# Altium schematic sheet Tubes_schematc.SchDoc
size A3; SheetNumber: 1; SheetTotal: 1
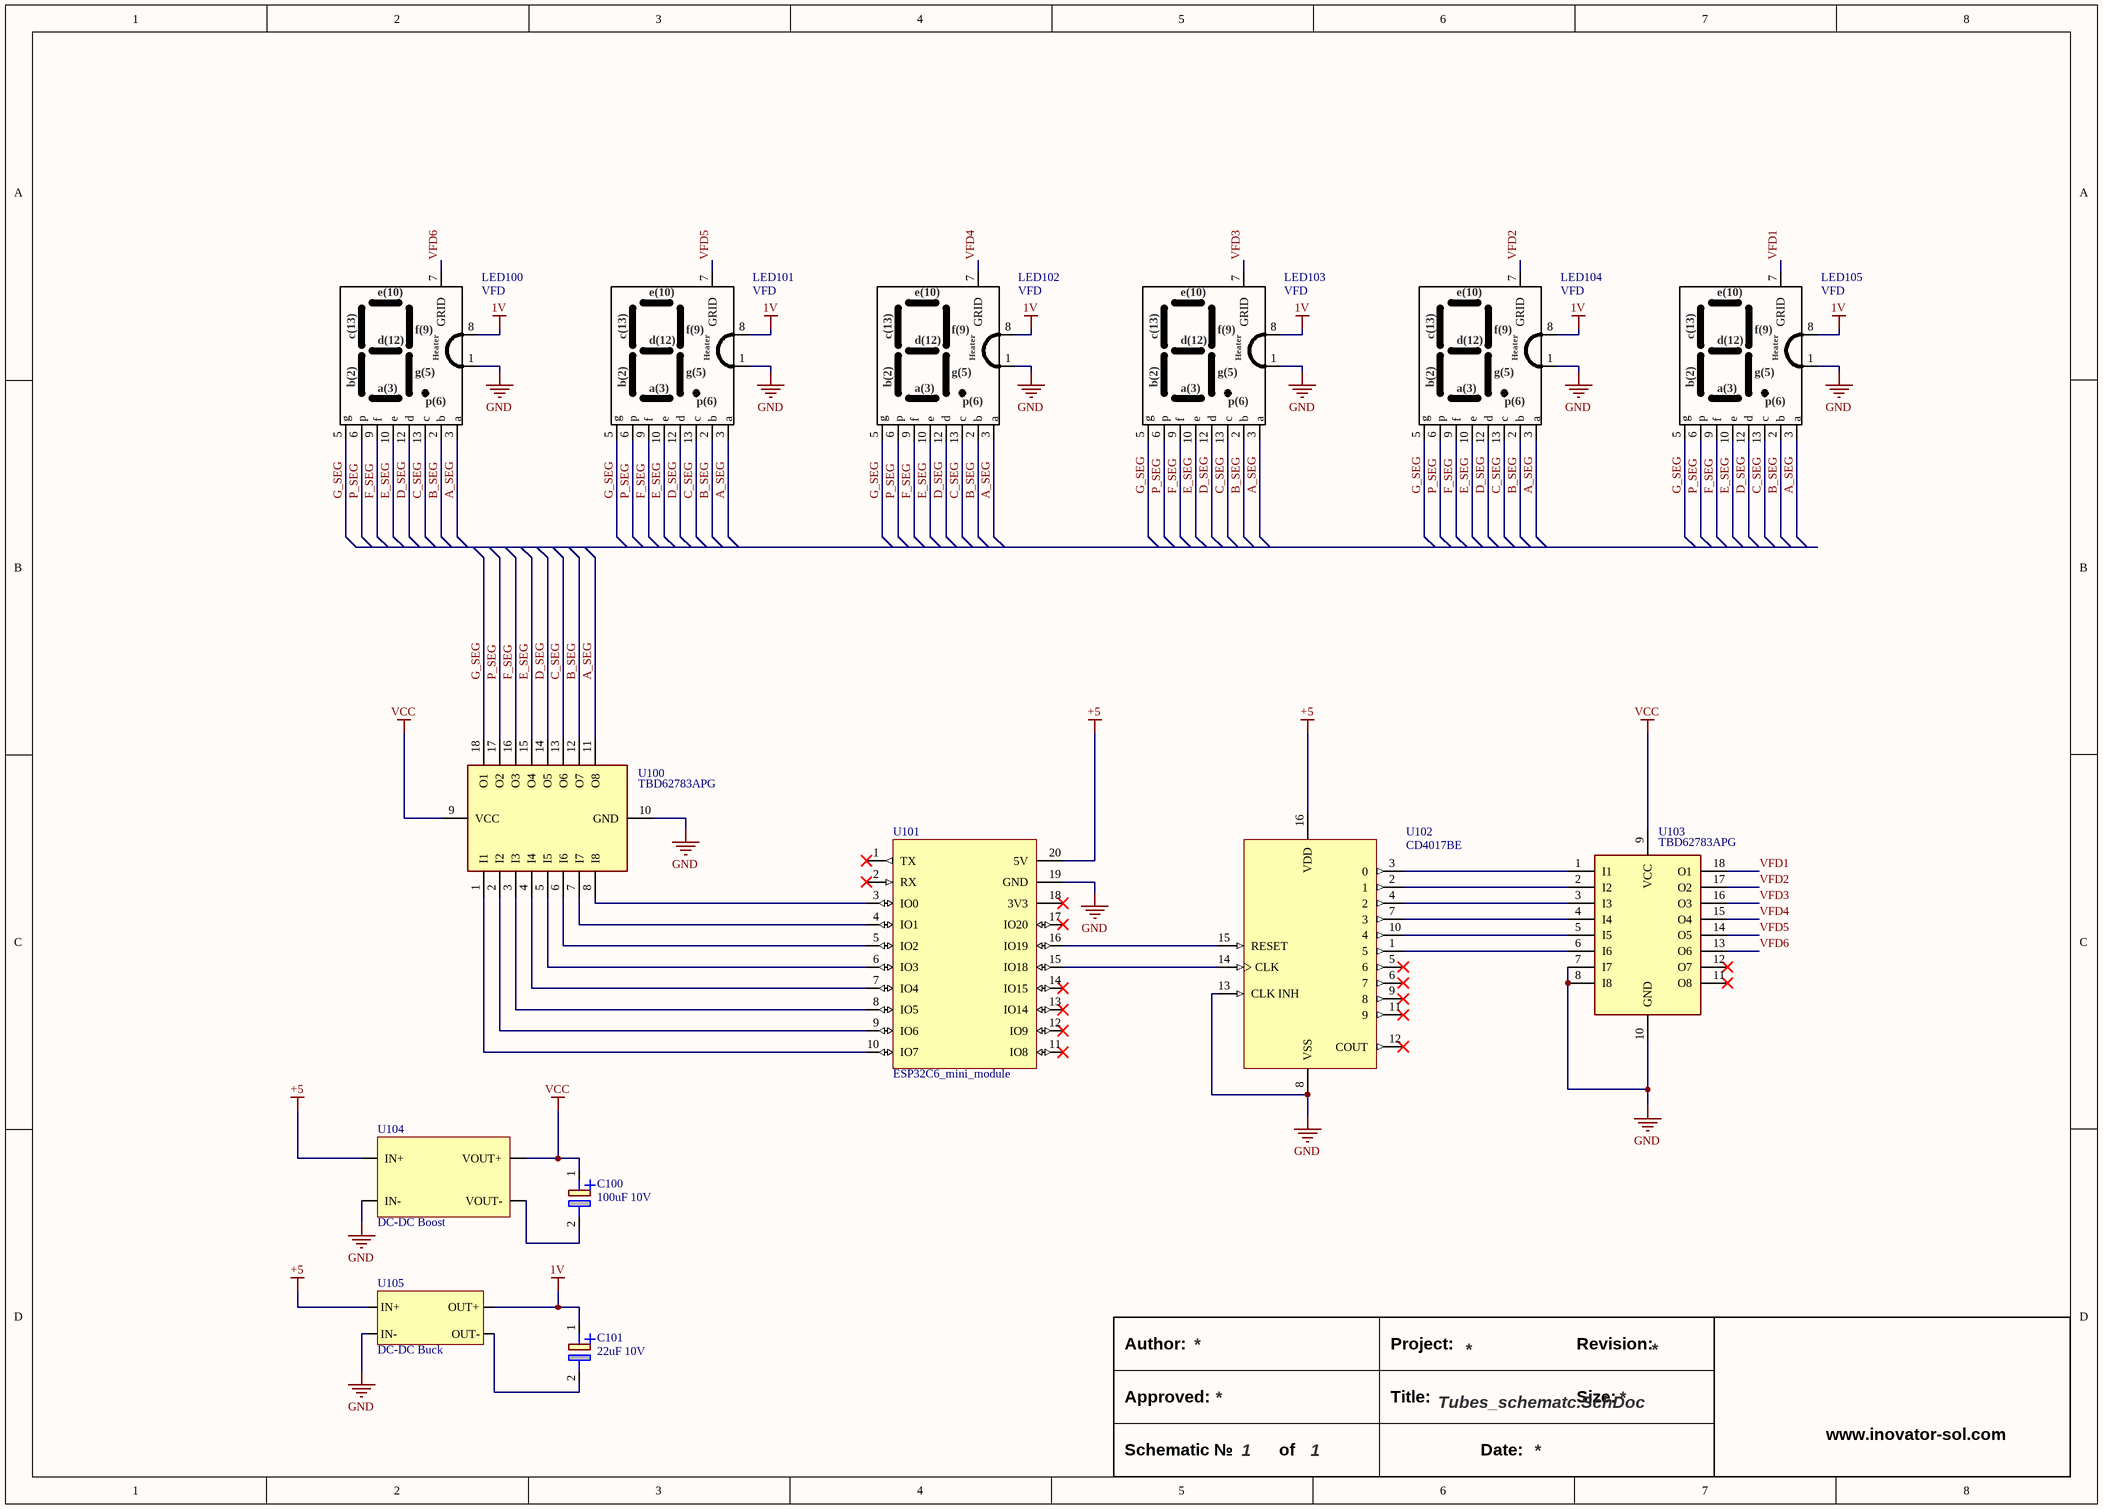
[diagram p0: Tubes_schematc.SchDoc]

## Parts
?  (no value)
C100  100uF 10V  [CAP_100u_10V_PRD250W50D630H800]
C101  22uF 10V  [CAP_D4mm_LS1.5mm]
LED100  VFD  [VFD_Tube_IV3]
LED101  VFD  [VFD_Tube_IV3]
LED102  VFD  [VFD_Tube_IV3]
LED103  VFD  [VFD_Tube_IV3]
LED104  VFD  [VFD_Tube_IV3]
LED105  VFD  [VFD_Tube_IV3]
U100  TBD62783APG  [TBD62783_DIP762W55P254L2286H480Q18N]
U101  ESP32C6_mini_module  [ESP32_minimodule - duplicate]
U102  CD4017BE  [CD4017_N0016A]
U103  TBD62783APG  [TBD62783_DIP762W55P254L2286H480Q18N]
U104  DC-DC Boost  [boost_mt3608]
U105  DC-DC Buck  [HW-187]

## Nets
1V: C101.1(+) LED100.8 LED101.8 LED102.8 LED103.8 LED104.8 LED105.8 U105.3(OUT+)
+5: U101.20(5V) U102.16(VDD) U104.2(IN+) U105.1(IN+)
GND: LED100.1 LED101.1 LED102.1 LED103.1 LED104.1 LED105.1 U100.10(GND) U101.19(GND) U102.8(VSS) U102.13(CLK_INH) U103.7(I7) U103.8(I8) U103.10(GND) U104.1(IN-) U105.2(IN-)
VCC: C100.1(+) U100.9(VCC) U103.9(VCC) U104.3(VOUT+)
A_SEG: LED100.3(a) LED101.3(a) LED102.3(a) LED103.3(a) LED104.3(a) LED105.3(a) U100.11(O8)
B_SEG: LED100.2(b) LED101.2(b) LED102.2(b) LED103.2(b) LED104.2(b) LED105.2(b) U100.12(O7)
C_SEG: LED100.13(c) LED101.13(c) LED102.13(c) LED103.13(c) LED104.13(c) LED105.13(c) U100.13(O6)
D_SEG: LED100.12(d) LED101.12(d) LED102.12(d) LED103.12(d) LED104.12(d) LED105.12(d) U100.14(O5)
E_SEG: LED100.10(e) LED101.10(e) LED102.10(e) LED103.10(e) LED104.10(e) LED105.10(e) U100.15(O4)
F_SEG: LED100.9(f) LED101.9(f) LED102.9(f) LED103.9(f) LED104.9(f) LED105.9(f) U100.16(O3)
G_SEG: LED100.5(g) LED101.5(g) LED102.5(g) LED103.5(g) LED104.5(g) LED105.5(g) U100.18(O1)
P_SEG: LED100.6(p) LED101.6(p) LED102.6(p) LED103.6(p) LED104.6(p) LED105.6(p) U100.17(O2)
VFD1: LED105.7(GRID) U103.18(O1)
VFD2: LED104.7(GRID) U103.17(O2)
VFD3: LED103.7(GRID) U103.16(O3)
VFD4: LED102.7(GRID) U103.15(O4)
VFD5: LED101.7(GRID) U103.14(O5)
VFD6: LED100.7(GRID) U103.13(O6)
NetC100_2: C100.2(-) U104.4(VOUT-)
NetC101_2: C101.2(-) U105.4(OUT-)
NetU100_1: U100.1(I1) U101.10(IO7)
NetU100_2: U100.2(I2) U101.9(IO6)
NetU100_3: U100.3(I3) U101.8(IO5)
NetU100_4: U100.4(I4) U101.7(IO4)
NetU100_5: U100.5(I5) U101.6(IO3)
NetU100_6: U100.6(I6) U101.5(IO2)
NetU100_7: U100.7(I7) U101.4(IO1)
NetU100_8: U100.8(I8) U101.3(IO0)
NetU101_15: U101.15(IO18) U102.14(CLK)
NetU101_16: U101.16(IO19) U102.15(RESET)
NetU102_1: U102.1(5) U103.6(I6)
NetU102_2: U102.2(1) U103.2(I2)
NetU102_3: U102.3(0) U103.1(I1)
NetU102_4: U102.4(2) U103.3(I3)
NetU102_7: U102.7(3) U103.4(I4)
NetU102_10: U102.10(4) U103.5(I5)

Not connected (* = marked no-connect by the designer): U101 1(TX)* 2(RX)* 11(IO8)* 12(IO9)* 13(IO14)* 14(IO15)* 17(IO20)* 18(3V3)*; U102 5(6)* 6(7)* 9(8)* 11(9)* 12(COUT)*; U103 11(O8)* 12(O7)*

## Notes on the sheet
- Author:
- Project:
- Revision:
- Approved:
- Schematic №
- of
- Title:
- Date:
- Size:
- www.inovator-sol.com <http://www.inovator-sol.com>
- (in symbol VFD_Tube) e(10); f(9); c(13); d(12); Heater; g(5); b(2); a(3); p(6)

## Library data of the parts
? = Title_Block_INOV_small: Title Block for A3 size sheet.
C100 = CAP_100u_10V: Cap Aluminum 100uF 10V 20% (6.3 X 7mm) Radial 2.5mm 80mA 1000 hr 85°C Bulk; Manufacturer: Panasonic; Manufacturer Part Number: ECE-A1AKA101; Supplier: Mouser; Supplier Part Number: 667-ECE-A1AKA101; RoHS: Yes; Category: Aluminum Electrolytic Capacitors; Stock: 46; Pricing: 1=0,21, 10=0,104, 50=0,104, 100=0,06, 1000=0,053, 10000=0,049 (USD); ComponentLink1URL: https://datasheet.ciiva.com/16390/aba0000ce20-16390502.pdf?src-supplier=Future+Electronics; ComponentLink1Description: https://datasheet.ciiva.com/16390/aba0000ce20-16390502.pdf?src-supplier=Future+Electronics; ComponentLink2URL: https://datasheet.ciiva.com/43459/1339511-43459559.pdf?src-supplier=Farnell; ComponentLink2Description: https://datasheet.ciiva.com/43459/1339511-43459559.pdf?src-supplier=Farnell; ComponentLink3URL: https://datasheet.ciiva.com/2984/aba0000ce20-2984487.pdf?src-supplier=Avnet; ComponentLink3Description: https://datasheet.ciiva.com/2984/aba0000ce20-2984487.pdf?src-supplier=Avnet; ComponentLink4URL: https://datasheet.ciiva.com/46397/1339511-46397446.pdf?src-supplier=Element14; ComponentLink4Description: https://datasheet.ciiva.com/46397/1339511-46397446.pdf?src-supplier=Element14
C101 = CAP_22u_10V_ECE-A1AKA220: Cap Aluminum 22uF 10V 20% Radial 1000h 85°C Bulk; Manufacturer: Panasonic; Supplier: Mouser; Supplier Part Number: 667-ECE-A1AKA220; Manufacturer Part Number: ECE-A1AKA220; RoHS: Yes; Category: Aluminum Electrolytic Capacitors; Stock: 1909; Pricing: 1=0,29, 10=0,136, 50=0,136, 100=0,071, 1000=0,056, 10000=0,044 (USD); ComponentLink1URL: https://datasheet.ciiva.com/46451/1339511-46451258.pdf?src-supplier=Element14; ComponentLink1Description: https://datasheet.ciiva.com/46451/1339511-46451258.pdf?src-supplier=Element14; ComponentLink2URL: https://datasheet.ciiva.com/30183/aba0000ce20-30183486.pdf?src-supplier=Onlinecomponents.com; ComponentLink2Description: https://datasheet.ciiva.com/30183/aba0000ce20-30183486.pdf?src-supplier=Onlinecomponents.com; ComponentLink3URL: https://datasheet.ciiva.com/2984/aba0000ce20-2984488.pdf?src-supplier=Avnet; ComponentLink3Description: https://datasheet.ciiva.com/2984/aba0000ce20-2984488.pdf?src-supplier=Avnet
LED100-LED105 = VFD_Tube: 96x10.6 mm
U100 U103 = TBD62783APG: Buffer/Inverter Based Peripheral Driver, 1 Driver, 0.4A, DMOS, PDIP18; Manufacturer: Toshiba; Interface: On/Off; Max Output current: 400mA; Max Supply Current: 1.5mA; Max Supply Voltage: 50V; Min Supply Voltage: 2V; Number of Channels: 8; Number of Transmitters: 1; Operating Supply Voltage: 5V; Output Configuration: High Side; Supplier: Mouser; Supplier Part Number: 757-TBD62783APG; Manufacturer Part Number: TBD62783APG; RoHS: Compliant; Category: Power Switch ICs - Power Distribution; Stock: 7346; Pricing: 1=2,34, 10=1,46, 50=1,4, 100=1,35, 1000=1,24, 10000=1,19 (USD); Case/Package: DIP; Height - Seated (Max): 4.8mm; Length: 22.86mm; Lifecycle Status: Production; Max Operating Temperature: 85°C; Min Operating Temperature: -40°C; Number of Circuits: 8; Number of Outputs: 8; Number of Terminals: 18; Output Voltage: 50V; Terminal Pitch: 2.54mm; Width: 7.62mm; ComponentLink1URL: https://datasheet.octopart.com:443/TBD62783APG-Toshiba-datasheet-68329876.pdf?src-supplier=IHS; ComponentLink1Description: https://datasheet.octopart.com:443/TBD62783APG-Toshiba-datasheet-68329876.pdf?src-supplier=IHS; Supplier 1: Mouser; Supplier Part Number 1: 757-TBD62783APG
U102 = CD4017BE: Counter; PDIP; Counter Logic; 3 V to 18 V; -55; +125; 0.04 Ua to 0.08 Ua Icc; 5; Manufacturer: Texas Instruments; Manufacturer Lifecycle Status: ACTIVE; Clock Edge Trigger Type: Positive Edge; Direction: Unidirectional; Frequency: 11MHz; Max Supply Voltage: 18V; Min Supply Voltage: 3V; Number of Bits: 4; Number of Bits per Element: 10; Number of Elements: 1; Output Current: 1.5mA; Propagation Delay: 650ns; Quiescent Current: 100µA; Reset: Asynchronous; Sync/Async: Synchronous; Supplier: Mouser; Supplier Part Number: 595-CD4017BE; Manufacturer Part Number: CD4017BE; RoHS: Compliant; Category: Counters; Stock: 2110; Pricing: 1=1,27, 10=0,925, 50=0,837, 100=0,741, 1000=0,621, 10000=0,581 (USD); Case/Package: PDIP; Contact Plating: Gold; Height: 5.08mm; Lead Free: Lead Free; Length: 19.3mm; Lifecycle Status: Production; Logic Function: Counter; Max Operating Temperature: 125°C; Min Operating Temperature: -55°C; Mounting Technology: Through Hole; Number of Gates: 1; Pins: 16; Radiation Hardening: No; REACH SVHC: No; Schedule B: 8542390000, 8542390000|8542390000, 8542390000|8542390000|8542390000, 8542390000|8542390000|8542390000|8542390000; Thickness: 3.9mm; Turn-On Delay Time: 650ns; Weight: 951.693491mg; Width: 6.35mm; ComponentLink1URL: https://datasheet.octopart.com:443/CD4017BE-Texas-Instruments-datasheet-10748468.pdf?src-supplier=Texas+Instruments; ComponentLink1Description: https://datasheet.octopart.com:443/CD4017BE-Texas-Instruments-datasheet-10748468.pdf?src-supplier=Texas+Instruments; ComponentLink2URL: https://octopart.com:443/opatz8j6/c1?t=3k2FlkM7OhGjdAJw6uhZRZPpAud7BMHweqXBytVZhQ-0jhG-GAdzlQ4I78FykeNzveRZRDiGEnOmJnlwhDAerQ7XerPQbRk9ZqJ8fh-JFk-NBA_p0G_aRaaikVjBOZGi7BDezEpwyn-qNc3O93cQt2BGGu1pbCULKfXSuZMFyH5194iACgutjtV10PeKfw8KVSf5UBK_cxFLQcQ_Dtbuyq01eNVVbC8C7D4Gu-3dAmmUk6EMk2ugf-3GnxnOYLmcxrl3Pf1NzwrCKC19ARxoh0WAkbMHR5DniOKtLLlwzOi4JBiMm2AJRkW_uFf62YSIH4NIdhS5Tqbpb7I73gYwReX-DItx6qbwlRk52w0fSslDk6iutyacFAlz__RbBUseuw&src-supplier=Texas+Instruments; ComponentLink2Description: https://octopart.com:443/opatz8j6/c1?t=3k2FlkM7OhGjdAJw6uhZRZPpAud7BMHweqXBytVZhQ-0jhG-GAdzlQ4I78FykeNzveRZRDiGEnOmJnlwhDAerQ7XerPQbRk9ZqJ8fh-JFk-NBA_p0G_aRaaikVjBOZGi7BDezEpwyn-qNc3O93cQt2BGGu1pbCULKfXSuZMFyH5194iACgutjtV10PeKfw8KVSf5UBK_cxFLQcQ_Dtbuyq01eNVVbC8C7D4Gu-3dAmmUk6EMk2ugf-3GnxnOYLmcxrl3Pf1NzwrCKC19ARxoh0WAkbMHR5DniOKtLLlwzOi4JBiMm2AJRkW_uFf62YSIH4NIdhS5Tqbpb7I73gYwReX-DItx6qbwlRk52w0fSslDk6iutyacFAlz__RbBUseuw&src-supplier=Texas+Instruments; ComponentLink3URL: https://datasheet.octopart.com:443/CD4017BE-Texas-Instruments-datasheet-10257688.pdf?src-supplier=Texas+Instruments; ComponentLink3Description: https://datasheet.octopart.com:443/CD4017BE-Texas-Instruments-datasheet-10257688.pdf?src-supplier=Texas+Instruments; ComponentLink4URL: https://datasheet.octopart.com:443/CD4017BE-Texas-Instruments-datasheet-151115.pdf?src-supplier=Texas+Instruments; ComponentLink4Description: https://datasheet.octopart.com:443/CD4017BE-Texas-Instruments-datasheet-151115.pdf?src-supplier=Texas+Instruments; ComponentLink5URL: https://sigma.octopart.com:443/49249812/technical_drawing/Texas-Instruments-CD4017BE.pdf?src-supplier=Texas+Instruments; ComponentLink5Description: https://sigma.octopart.com:443/49249812/technical_drawing/Texas-Instruments-CD4017BE.pdf?src-supplier=Texas+Instruments; ComponentLink6URL: https://datasheet.octopart.com:443/CD4017BE-Texas-Instruments-datasheet-47642656.pdf?src-supplier=element14+APAC; ComponentLink6Description: https://datasheet.octopart.com:443/CD4017BE-Texas-Instruments-datasheet-47642656.pdf?src-supplier=element14+APAC; ComponentLink7URL: https://datasheet.octopart.com:443/CD4017BE-Texas-Instruments-datasheet-102486847.pdf?src-supplier=element14+APAC; ComponentLink7Description: https://datasheet.octopart.com:443/CD4017BE-Texas-Instruments-datasheet-102486847.pdf?src-supplier=element14+APAC; ComponentLink8URL: https://datasheet.octopart.com:443/CD4017BE-Texas-Instruments-datasheet-27379339.pdf?src-supplier=Farnell; ComponentLink8Description: https://datasheet.octopart.com:443/CD4017BE-Texas-Instruments-datasheet-27379339.pdf?src-supplier=Farnell; ComponentLink9URL: https://datasheet.octopart.com:443/CD4017BE-Texas-Instruments-datasheet-21412874.pdf?src-supplier=Farnell; ComponentLink9Description: https://datasheet.octopart.com:443/CD4017BE-Texas-Instruments-datasheet-21412874.pdf?src-supplier=Farnell; ComponentLink10URL: https://datasheet.octopart.com:443/CD4017BE-Texas-Instruments-datasheet-31678.pdf?src-supplier=Newark; ComponentLink10Description: https://datasheet.octopart.com:443/CD4017BE-Texas-Instruments-datasheet-31678.pdf?src-supplier=Newark; ComponentLink11URL: https://datasheet.octopart.com:443/CD4017BE-Texas-Instruments-datasheet-177784054.pdf?src-supplier=Burklin+Elektronik; ComponentLink11Description: https://datasheet.octopart.com:443/CD4017BE-Texas-Instruments-datasheet-177784054.pdf?src-supplier=Burklin+Elektronik; ComponentLink12URL: https://datasheet.octopart.com:443/CD4017BE-Texas-Instruments-datasheet-164413264.pdf?src-supplier=SHENGYU+ELECTRONICS; ComponentLink12Description: https://datasheet.octopart.com:443/CD4017BE-Texas-Instruments-datasheet-164413264.pdf?src-supplier=SHENGYU+ELECTRONICS; ComponentLink13URL: https://datasheet.octopart.com:443/CD4017BE-Texas-Instruments-datasheet-160672318.pdf?src-supplier=LCSC; ComponentLink13Description: https://datasheet.octopart.com:443/CD4017BE-Texas-Instruments-datasheet-160672318.pdf?src-supplier=LCSC; ComponentLink14URL: https://datasheet.octopart.com:443/CD4017BE-Texas-Instruments-datasheet-159114753.pdf?src-supplier=LCSC; ComponentLink14Description: https://datasheet.octopart.com:443/CD4017BE-Texas-Instruments-datasheet-159114753.pdf?src-supplier=LCSC; ComponentLink15URL: https://datasheet.octopart.com:443/CD4017BE-Texas-Instruments-datasheet-14145910.pdf?src-supplier=iiiC; ComponentLink15Description: https://datasheet.octopart.com:443/CD4017BE-Texas-Instruments-datasheet-14145910.pdf?src-supplier=iiiC; ComponentLink16URL: https://datasheet.octopart.com:443/CD4017BE-Texas-Instruments-datasheet-8369086.pdf?src-supplier=element14; ComponentLink16Description: https://datasheet.octopart.com:443/CD4017BE-Texas-Instruments-datasheet-8369086.pdf?src-supplier=element14; ComponentLink17URL: https://datasheet.octopart.com:443/CD4017BE-Texas-Instruments-datasheet-5333222.pdf?src-supplier=Verical; ComponentLink17Description: https://datasheet.octopart.com:443/CD4017BE-Texas-Instruments-datasheet-5333222.pdf?src-supplier=Verical; ComponentLink18URL: https://datasheet.octopart.com:443/CD4017BE-Texas-Instruments-datasheet-7284308.pdf?src-supplier=Jameco; ComponentLink18Description: https://datasheet.octopart.com:443/CD4017BE-Texas-Instruments-datasheet-7284308.pdf?src-supplier=Jameco; ComponentLink19URL: https://datasheet.octopart.com:443/CD4017BE-Texas-Instruments-datasheet-98236.pdf?src-supplier=RS+(Formerly+Allied+Electronics); ComponentLink19Description: https://datasheet.octopart.com:443/CD4017BE-Texas-Instruments-datasheet-98236.pdf?src-supplier=RS+(Formerly+Allied+Electronics); ComponentLink20URL: https://datasheet.octopart.com:443/CD4017BE-Texas-Instruments-datasheet-115811.pdf?src-supplier=Sierra+IC; ComponentLink20Description: https://datasheet.octopart.com:443/CD4017BE-Texas-Instruments-datasheet-115811.pdf?src-supplier=Sierra+IC; ComponentLink21URL: http://sigma.octopart.com:80/conflict_mineral_statement/Texas-Instruments-company-63.pdf?src-supplier=Compliance+Statements; ComponentLink21Description: http://sigma.octopart.com:80/conflict_mineral_statement/Texas-Instruments-company-63.pdf?src-supplier=Compliance+Statements; ComponentLink22URL: http://sigma.octopart.com:80/reach_statement/Texas-Instruments-company-64.pdf?src-supplier=Compliance+Statements; ComponentLink22Description: http://sigma.octopart.com:80/reach_statement/Texas-Instruments-company-64.pdf?src-supplier=Compliance+Statements
U104 = MODULE_MT3608: Step-up Boost Converter MT3608 2A
U105 = HW-187: DC-DC 4.7V-23V to 1V-17V Buck Converter Step Down